# Altium schematic sheet bme_affect_sen_brd.SchDoc
size A4
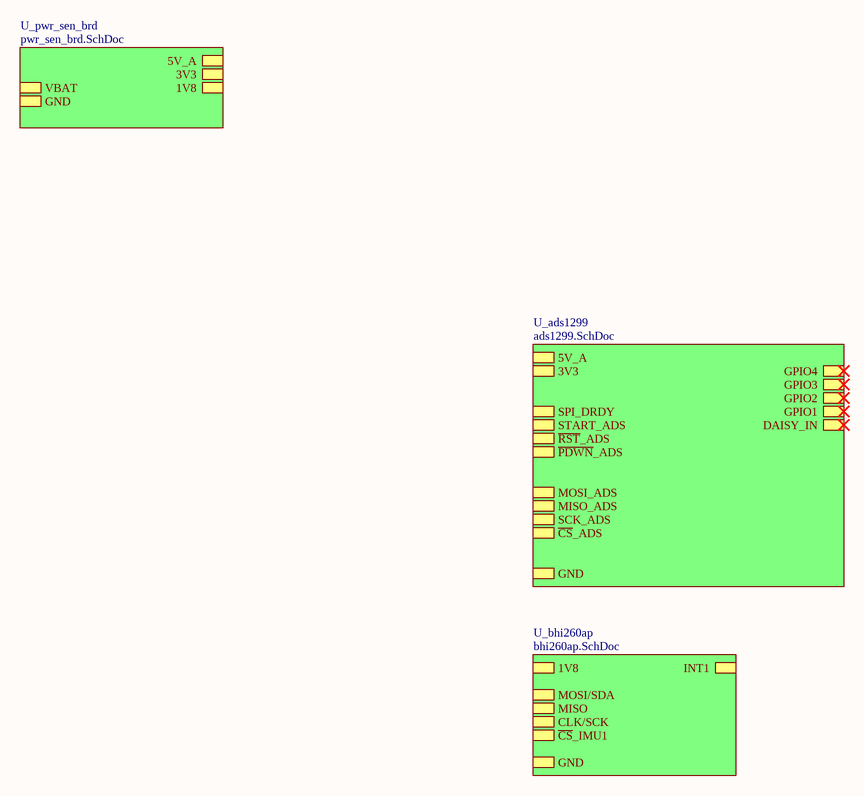
[diagram p0: bme_affect_sen_brd.SchDoc]

## Sub-sheets
U_ads1299 = ads1299.SchDoc: SPI_DRDY, GPIO4, GPIO2, GPIO3, START_ADS, GPIO1, DAISY_IN, 3V3, 5V_A, GND, ~{CS}_ADS, MISO_ADS, MOSI_ADS, SCK_ADS, ~{RST}_ADS, ~{PDWN}_ADS
U_bhi260ap = bhi260ap.SchDoc: 1V8, GND, ~{CS}_IMU1, CLK/SCK, MOSI/SDA, MISO, INT1
U_pwr_sen_brd = pwr_sen_brd.SchDoc: 5V_A, 1V8, VBAT, GND, 3V3